# EAGLE design mega tqfp (EAGLE 5.07)
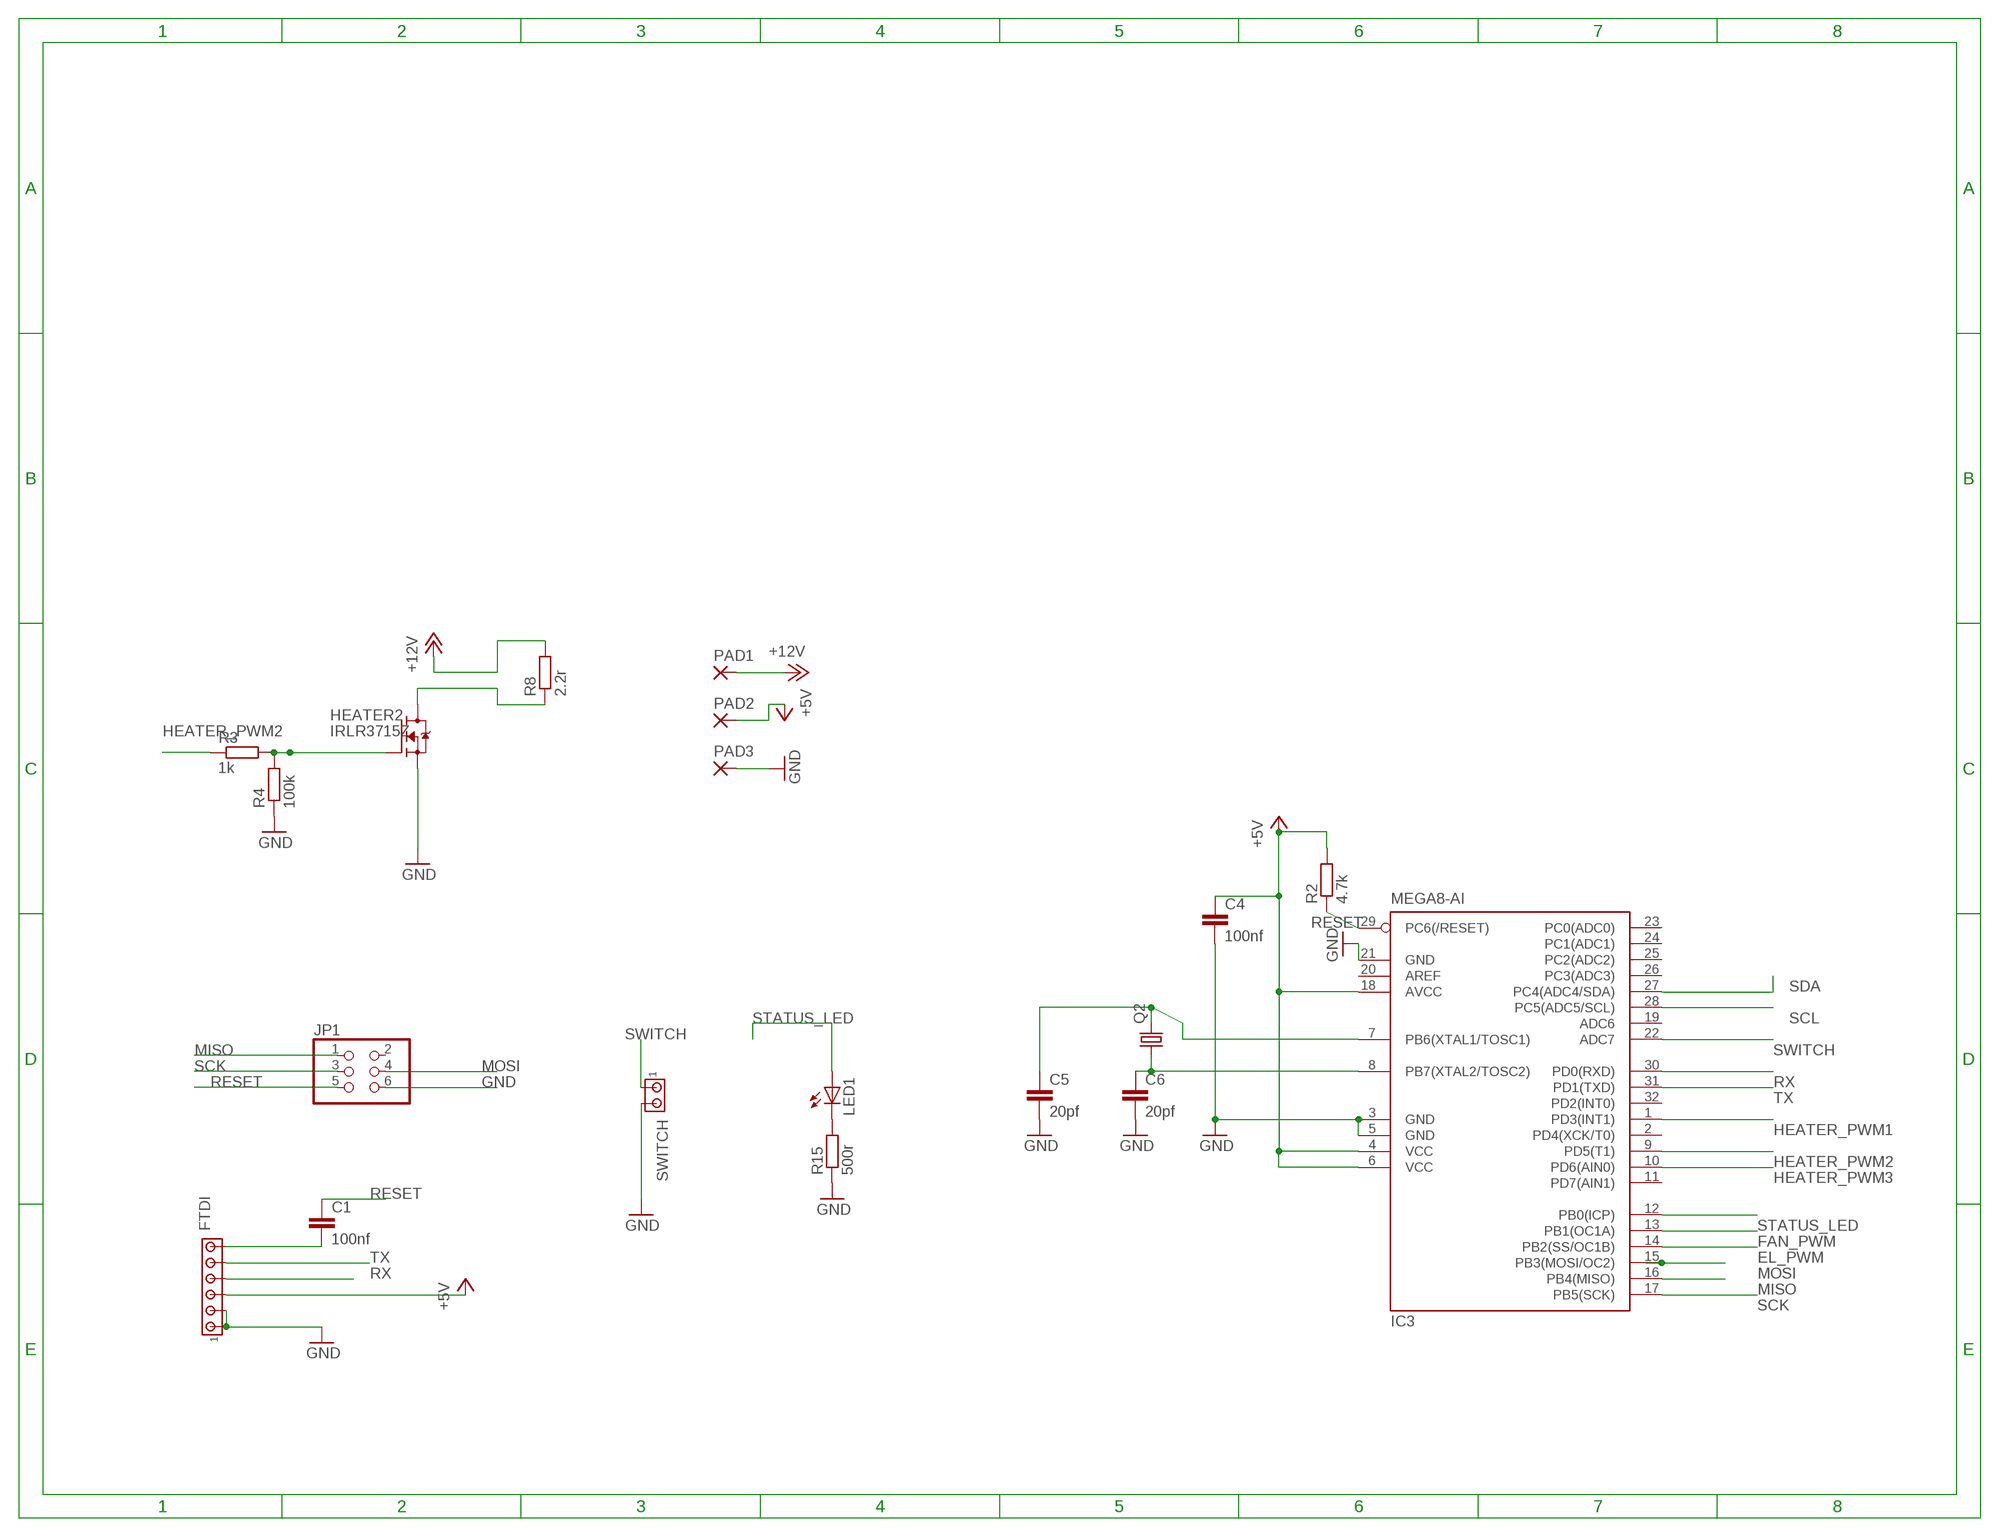
[diagram p0: schematic, sheet 1]

## Parts
C1  100nf  C-EUC1206  [C1206]
C4  100nf  C-EUC1206  [C1206]
C5  20pf  C-EUC1206  [C1206]
C6  20pf  C-EUC1206  [C1206]
FTDI  MTA06-100  [10X06MTA]
HEATER2  IRLR3715Z  [TO252]
IC3  MEGA8-AI  [TQFP32-08]
JP1  PINHD-2X3  [2X03]
LED1  LEDCHIPLED_1206  [CHIPLED_1206]
PAD1  2,54/1,0  [2,54/1,0]
PAD2  2,54/1,0  [2,54/1,0]
PAD3  2,54/1,0  [2,54/1,0]
Q2  CRYSTALHC49UP  [HC49UP]
R2  4.7k  R-EU_R1206  [R1206]
R3  1k  R-EU_M1206  [M1206]
R4  100k  R-EU_M1206  [M1206]
R8  2.2r  R-EU_0613/15  [P0613/15]
R15  500r  R-EU_R1206  [R1206]
SWITCH  MTA02-100  [10X02MTA]

## Nets
+5V: C4.1 FTDI.4 IC3.4(VCC) IC3.6(VCC) IC3.18(AVCC) PAD2.1(P) R2.2
+12V [power]: PAD1.1(P) R8.2
EL_PWM: IC3.14(PB2(SS/OC1B))
FAN_PWM: IC3.13(PB1(OC1A))
GND [power]: C4.2 C5.2 C6.2 FTDI.5 FTDI.6 HEATER2.2(S) IC3.3(GND) IC3.5(GND) IC3.21(GND) JP1.6 PAD3.1(P) R4.1 R15.1 SWITCH.2
HEATER1 [medpower]: HEATER2.3(D) R8.1
HEATER_PWM1: IC3.1(PD3(INT1))
HEATER_PWM2: IC3.9(PD5(T1)) R3.1
HEATER_PWM3: IC3.10(PD6(AIN0))
MISO: IC3.16(PB4(MISO)) JP1.1
MOSI: IC3.15(PB3(MOSI/OC2)) JP1.4
N$1: HEATER2.1(G) R3.2 R4.2
N$5: C1.2 FTDI.1
N$7: LED1.C R15.2
N$10: C6.1 IC3.8(PB7(XTAL2/TOSC2)) Q2.1
N$11: C5.1 IC3.7(PB6(XTAL1/TOSC1)) Q2.2
RESET: C1.1 IC3.29(PC6(/RESET)) JP1.5 R2.1
RX: FTDI.3 IC3.30(PD0(RXD))
SCK: IC3.17(PB5(SCK)) JP1.3
SCL: IC3.28(PC5(ADC5/SCL))
SDA: IC3.27(PC4(ADC4/SDA))
STATUS_LED: IC3.12(PB0(ICP)) LED1.A
SWITCH: IC3.22(ADC7) SWITCH.1
TX: FTDI.2 IC3.31(PD1(TXD))
Unconnected: IC3.2(PD4(XCK/T0)) IC3.11(PD7(AIN1)) IC3.19(ADC6) IC3.20(AREF) IC3.23(PC0(ADC0)) IC3.24(PC1(ADC1)) IC3.25(PC2(ADC2)) IC3.26(PC3(ADC3)) IC3.32(PD2(INT0)) JP1.2

## Library data of the parts
C1 C4-C6 = matt rcl:C-EU: CAPACITOR, European symbol
FTDI = matt con-amp:MTA06-100: AMP connector
HEATER2 = matt transistor-fet:IRLR3715Z
IC3 = matt atmel:MEGA8: MICROCONTROLLER 8 Kbytes FLASH, 1 kbytes SRAM, 512 bytes EEPROM, USART, 6-channel 10 bit ADC, 2-channel 8 bit ADC Pin compatible with Atmega48, ATMega88, ATMega168 Source: avr.lbr
JP1 = pinhead:PINHD-2X3: PIN HEADER
LED1 = led:LED: LED OSRAM: - CHIPLED LG R971, LG N971, LY N971, LG Q971, LY Q971, LO R971, LY R971 LH N974, LH R974 LS Q976, LO Q976, LY Q976 LO Q996 - Hyper CHIPLED LW Q18S LB Q993, LB Q99A, LB R99A - SideLED LS A670, LO A670, LY A670, LG A670, LP A670 LB A673, LV A673, LT A673, LW A673 LH A674 LY A675 LS A676, LA A676, LO A676, LY A676, LW A676 LS A679, LY A679, LG A679 - Hyper Micro SIDELED® LS Y876, LA Y876, LO Y876, LY Y876 LT Y87S - SmartLED LW L88C, LW L88S LB L89C, LB L89S, LG L890 LS L89K, LO L89K, LY L89K LS L896, LA L896, LO L896, LY L896 - TOPLED LS T670, LO T670, LY T670, LG T670, LP T670 LSG T670, LSP T670, LSY T670, LOP T670, LYG T670 LG T671, LOG T671, LSG T671 LB T673, LV T673, LT T673, LW T673 LH T674 LS T676, LA T676, LO T676, LY T676, LB T676, LH T676, LSB T676, LW T676 LB T67C, LV T67C, LT T67C, LS T67K, LO T67K, LY T67K, LW E67C LS E67B, LA E67B, LO E67B, LY E67B, LB E67C, LV E67C, LT E67C LW T67C LS T679, LY T679, LG T679 LS T770, LO T770, LY T770, LG T770, LP T770 LB T773, LV T773, LT T773, LW T773 LH T774 LS E675, LA E675, LY E675, LS T675 LS T776, LA T776, LO T776, LY T776, LB T776 LHGB T686 LT T68C, LB T68C - Hyper Mini TOPLED® LB M676 - Mini TOPLED Santana® LG M470 LS M47K, LO M47K, LY M47K Source: http://www.osram.convergy.de LUXEON: - LUMILED® LXK2-PW12-R00, LXK2-PW12-S00, LXK2-PW14-U00, LXK2-PW14-V00 LXK2-PM12-R00, LXK2-PM12-S00, LXK2-PM14-U00 LXK2-PE12-Q00, LXK2-PE12-R00, LXK2-PE12-S00, LXK2-PE14-T00, LXK2-PE14-U00 LXK2-PB12-K00, LXK2-PB12-L00, LXK2-PB12-M00, LXK2-PB14-N00, LXK2-PB14-P00, LXK2-PB14-Q00 LXK2-PR12-L00, LXK2-PR12-M00, LXK2-PR14-Q00, LXK2-PR14-R00 LXK2-PD12-Q00, LXK2-PD12-R00, LXK2-PD12-S00 LXK2-PH12-R00, LXK2-PH12-S00 LXK2-PL12-P00, LXK2-PL12-Q00, LXK2-PL12-R00 Source: www.luxeon.com KINGBRIGHT: KA-3528ASYC Source: www.kingbright.com
PAD1-PAD3 = wirepad:2,54/1,0: THROUGH-HOLE PAD
Q2 = crystal:CRYSTAL: CRYSTAL
R2 R8 R15 = matt rcl:R-EU_: RESISTOR, European symbol
R3 R4 = resistor:R-EU_: RESISTOR, European symbol
SWITCH = matt con-amp:MTA02-100: AMP connector

## Net classes
0 default: width 0.5 mm
1 power: width 1 mm
2 medpower: width 1 mm

## Board
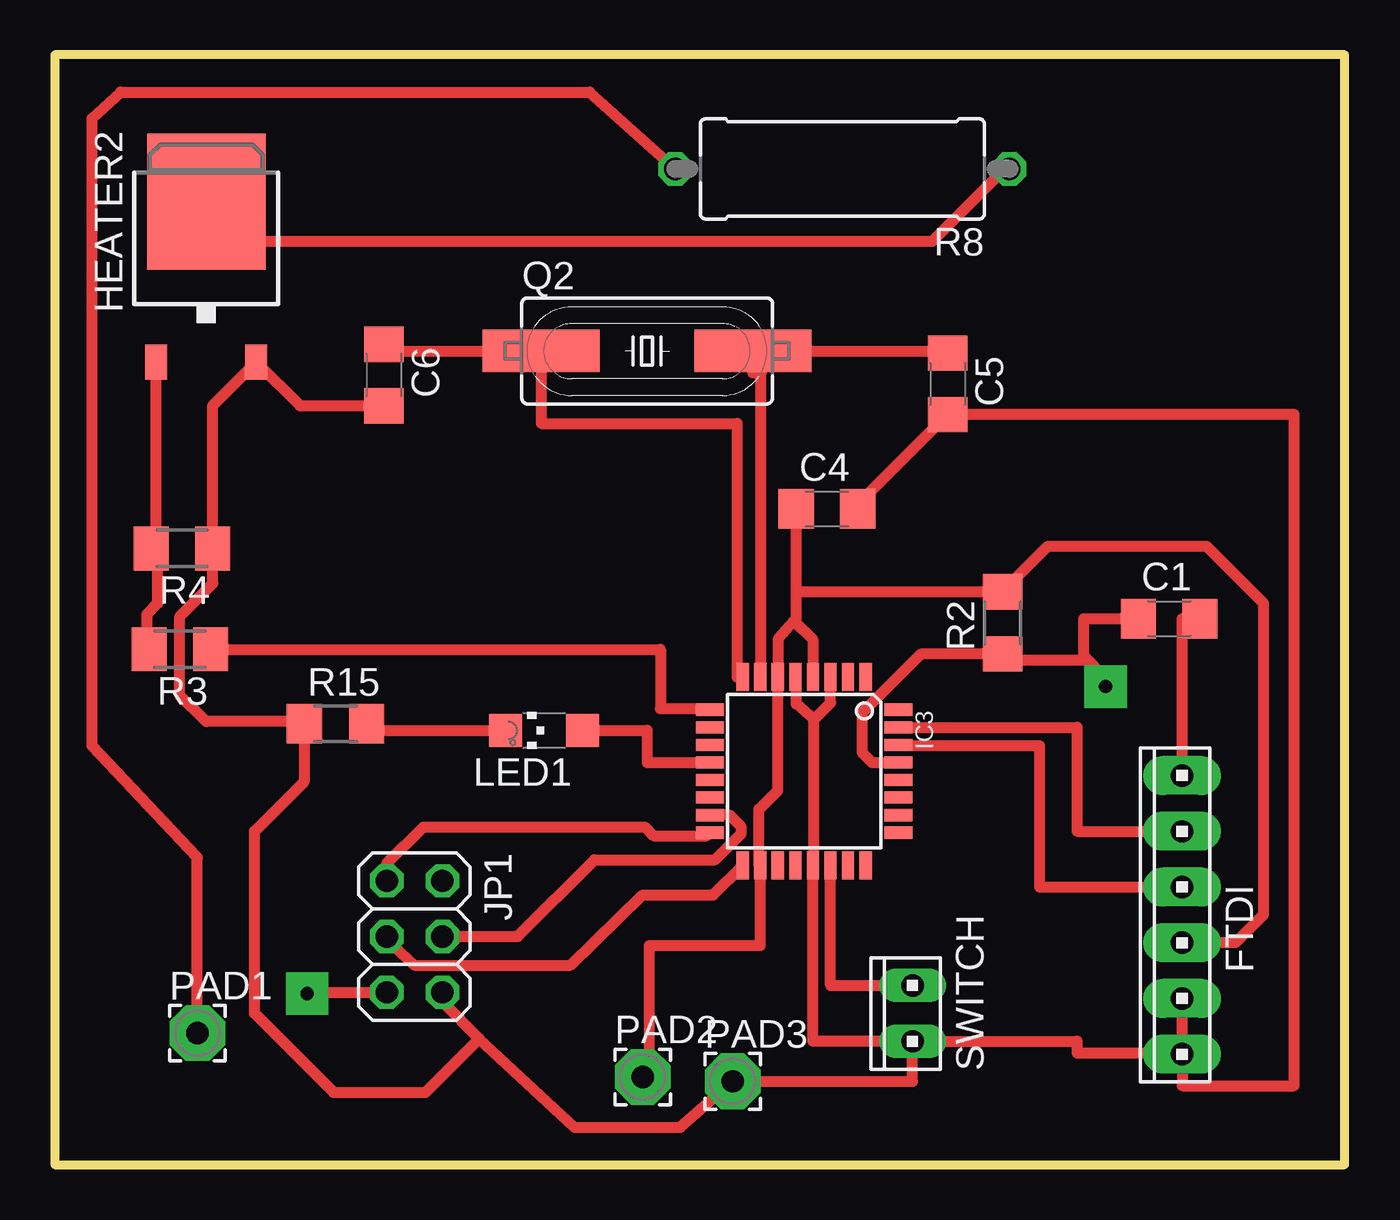
[diagram p1: board, top side]
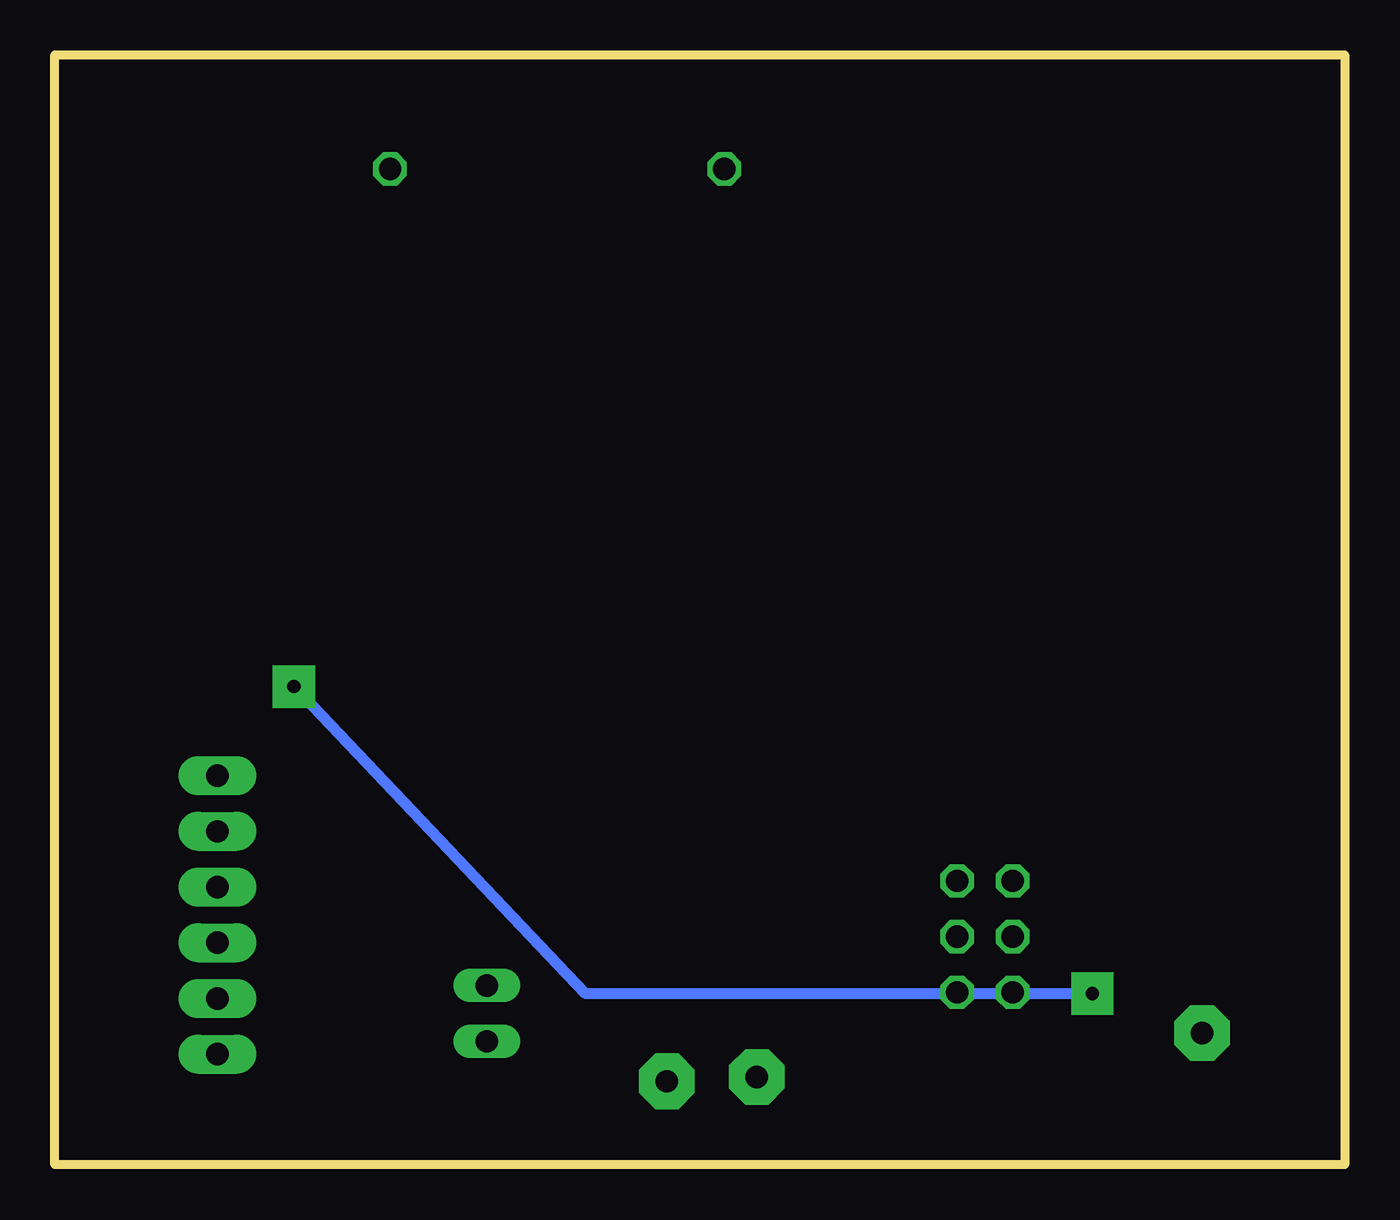
[diagram p2: board, bottom side, seen from below]

Size 58.8 x 50.6 mm. Coordinates in mm from the lower left corner, seen from the top.
Outline: 0,0 58.8,0 58.8,50.6 0,50.6 0,0
Copper layers (1*16): Top 0.035mm / dielectric 1.5mm / Bottom 0.035mm
Design rules "default": minimum track width 10mil, minimum drill 24mil, track to track 8mil, track to pad 8mil, pad to pad 8mil, via to via 8mil, smd to smd 8mil, copper to edge 40mil, drill to drill 8mil, minimum pad ring 10mil, minimum via ring 8mil, stop-mask expansion 4mil, vias tented up to drill 0mil, thermal gap 10mil

### Footprints (pad centres in the part's own frame; a part is rotated, then mirrored left to right if it is on the bottom)
C1206 = smd 1.6 x 1.8: 1 -1.4,0; 2 1.4,0
10X06MTA = drill 1.016 pad 1.778 long: 1 6.35,0; 2 3.81,0; 3 1.27,0; 4 -1.27,0; 5 -3.81,0; 6 -6.35,0
TO252 = smd 1 x 1.6: 1 -2.28,-4.8; 2 2.28,-4.8 | smd 5.4 x 6.2: 3 0,2.5
TQFP32-08 = smd 1.27 x 0.559: 1 -4.293,2.8; 2 -4.293,2; 3 -4.293,1.2; 4 -4.293,0.4; 5 -4.293,-0.4; 6 -4.293,-1.2; 7 -4.293,-2; 8 -4.293,-2.8; 17 4.293,-2.8; 18 4.293,-2; 19 4.293,-1.2; 20 4.293,-0.4; 21 4.293,0.4; 22 4.293,1.2; 23 4.293,2; 24 4.293,2.8 | smd 0.559 x 1.27: 9 -2.8,-4.293; 10 -2,-4.293; 11 -1.2,-4.293; 12 -0.4,-4.293; 13 0.4,-4.293; 14 1.2,-4.293; 15 2,-4.293; 16 2.8,-4.293; 25 2.8,4.293; 26 2,4.293; 27 1.2,4.293; 28 0.4,4.293; 29 -0.4,4.293; 30 -1.2,4.293; 31 -2,4.293; 32 -2.8,4.293
2X03 = drill 1.016 octagon: 1 -2.54,-1.27; 2 -2.54,1.27; 3 0,-1.27; 4 0,1.27; 5 2.54,-1.27; 6 2.54,1.27
CHIPLED_1206 = smd 1.5 x 1.5: A 0,-1.75; C 0,1.75
2,54/1,0 = drill 1.016 pad 2.54 octagon: 1 0,0
HC49UP = smd 5.334 x 1.93: 1 -4.826,0; 2 4.826,0
R1206 = smd 1.6 x 1.803: 1 -1.422,0; 2 1.422,0
M1206 = smd 1.6 x 2: 1 -1.4,0; 2 1.4,0
P0613/15 = drill 1.016 octagon: 1 -7.62,0; 2 7.62,0
10X02MTA = drill 1.016 long: 1 1.27,0; 2 -1.27,0

### Placement (x,y rotation side)
C1  50.8,24.9 0 top
C4  35.2,29.9 0 top
C5  40.7,35.6 270 top
C6  15,36 270 top
FTDI  51.39,11.39 90 top
HEATER2  6.9,41.4 0 top
IC3  34.16,17.94 270 top
JP1  16.4,10.4 270 top
LED1  22.3,19.8 90 top
PAD1  6.5,6 0 top
PAD2  26.8,4 0 top
PAD3  30.9,3.8 0 top
Q2  27,37.1 0 top
R2  43.2,24.7 90 top
R3  5.7,23.5 180 top
R4  5.8,28.1 180 top
R8  35.9,45.4 180 top
R15  12.8,20.1 0 top
SWITCH  39.1,6.9 90 top

### Tracks (layer width: path | path; a pad name or v marks a point on that pad's centre or on a via)
+5V
  Top 0.5: PAD2.1 27.1,4 27.1,10 32.16,10 IC3.18 32.1,13.71 32.1,16.2 32.96,17.06 IC3.6 33,22.29 33,24 33.7,24.8 | FTDI.4 53.82,10.12 55.1,11.4 55.1,25.6 52.5,28.2 45.28,28.2 R2.2 33.92,26.12 33.8,26 | 33.8,26 33.8,24.9 33.7,24.8 | 33.8,26 C4.1 | IC3.4 34.56,23.94 33.7,24.8
+12V
  Top 0.5: PAD1.1 6.5,14 1.7,19.1 1.7,47.7 3,48.9 24.38,48.9 R8.2
GND
  Top 0.5: SWITCH.2 34.56,5.63 IC3.21 34.6,13.69 34.6,20.3 | SWITCH.2 46.6,5.63 46.6,5.1 51.39,5.1 FTDI.6 | SWITCH.2 39.1,3.8 PAD3.1 28.5,1.7 23.7,1.7 19.35,5.75 | FTDI.6 51.39,3.6 56.5,3.6 56.5,34.2 C5.2 36.6,30.1 C4.2 | C6.2 11.18,34.6 HEATER2.2 7.2,34.62 R4.1 7.2,26.5 5.7,25 5.7,21.4 6.9,20.2 11.28,20.2 R15.1 11.38,17.48 9.1,15.2 9.1,6.9 12.7,3.3 16.9,3.3 19.35,5.75 | JP1.6 17.67,7.43 19.35,5.75 | IC3.3 35.36,21.06 34.6,20.3 | 34.6,20.3 33.8,21 33.8,22.09 IC3.5 | FTDI.6 FTDI.5
HEATER1
  Top 0.5: R8.1 43.3,45.4 40,42.1 8.7,42.1 HEATER2.3
HEATER_PWM2
  Top 0.5: R3.1 27.6,23.5 27.6,20.8 29.87,20.8 IC3.9
MISO
  Top 0.5: JP1.1 15.13,13.73 16.8,15.4 26.9,15.4 27.3,15 29.73,15 IC3.16
MOSI
  Top 0.5: IC3.15 30.76,15.94 31.3,15.4 31.3,15.1 30.1,13.9 24.6,13.9 21.1,10.4 JP1.4
N$1
  Top 0.5: HEATER2.1 4.62,27.68 4.7,27.6 | 4.7,27.6 4.7,25.6 4.2,25.1 4.2,23.6 R3.2 | 4.7,27.6 4.7,27.8 R4.2
N$5
  Top 0.5: C1.2 51.39,24.9 FTDI.1
N$7
  Top 0.5: LED1.C 14.22,19.8 R15.2
N$10
  Top 0.5: IC3.8 31.1,22.23 31.1,33.8 22.17,33.8 Q2.1 15,37.1 C6.1
N$11
  Top 0.5: IC3.7 32.2,22.23 32.2,36.1 31.83,36.1 Q2.2 41.3,37.1 41.3,36.9 40.7,36.9 C5.1
RESET  (via drill 0.6 pad 1.93)
  Top 0.5: C1.1 46.9,24.9 46.9,23.2 | 46.9,23.2 46.9,23 43.2,23 R2.1 39.48,23.28 36.8,20.6 36.8,18.8 37.26,18.34 IC3.29 | JP1.5 11.56,7.86 v11.5,7.8 | v47.9,21.8 47.9,22.2 46.9,23.2
  Bottom 0.5: v11.5,7.8 34.6,7.8 v47.9,21.8
RX
  Top 0.5: FTDI.3 44.9,12.66 44.9,19.1 38.45,19.1 IC3.30
SCK
  Top 0.5: JP1.3 15.13,10.27 16.4,9.1 23.5,9.1 26.8,12.3 30.01,12.3 IC3.17
STATUS_LED
  Top 0.5: IC3.12 27,18.34 27,19.8 LED1.A
SWITCH
  Top 0.5: SWITCH.1 35.36,8.17 IC3.22
TX
  Top 0.5: IC3.31 46.6,19.94 46.6,15.2 FTDI.2